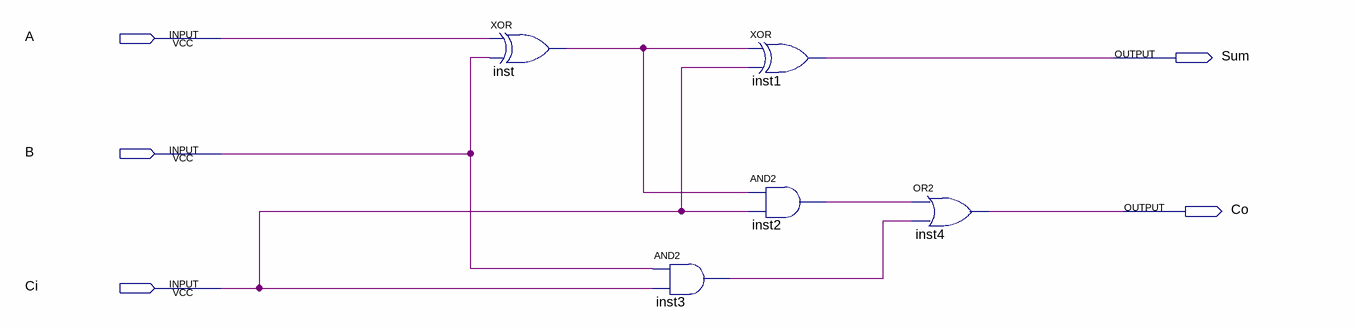
[diagram p0: schematic sheet]
// Quartus schematic Full_adder.bdf as structural Verilog: 5 symbols, 5 pins
module Full_adder (
  input  A,
  input  B,
  input  Ci,
  output Sum,
  output Co
);

  wire inst2_out, inst3_out, inst_out;

  xor inst (inst_out, A, B);
  and inst3 (inst3_out, B, Ci);
  xor inst1 (Sum, inst_out, Ci);
  and inst2 (inst2_out, inst_out, Ci);
  or inst4 (Co, inst2_out, inst3_out);
endmodule
